# Altium project PLC M3.PrjPcb
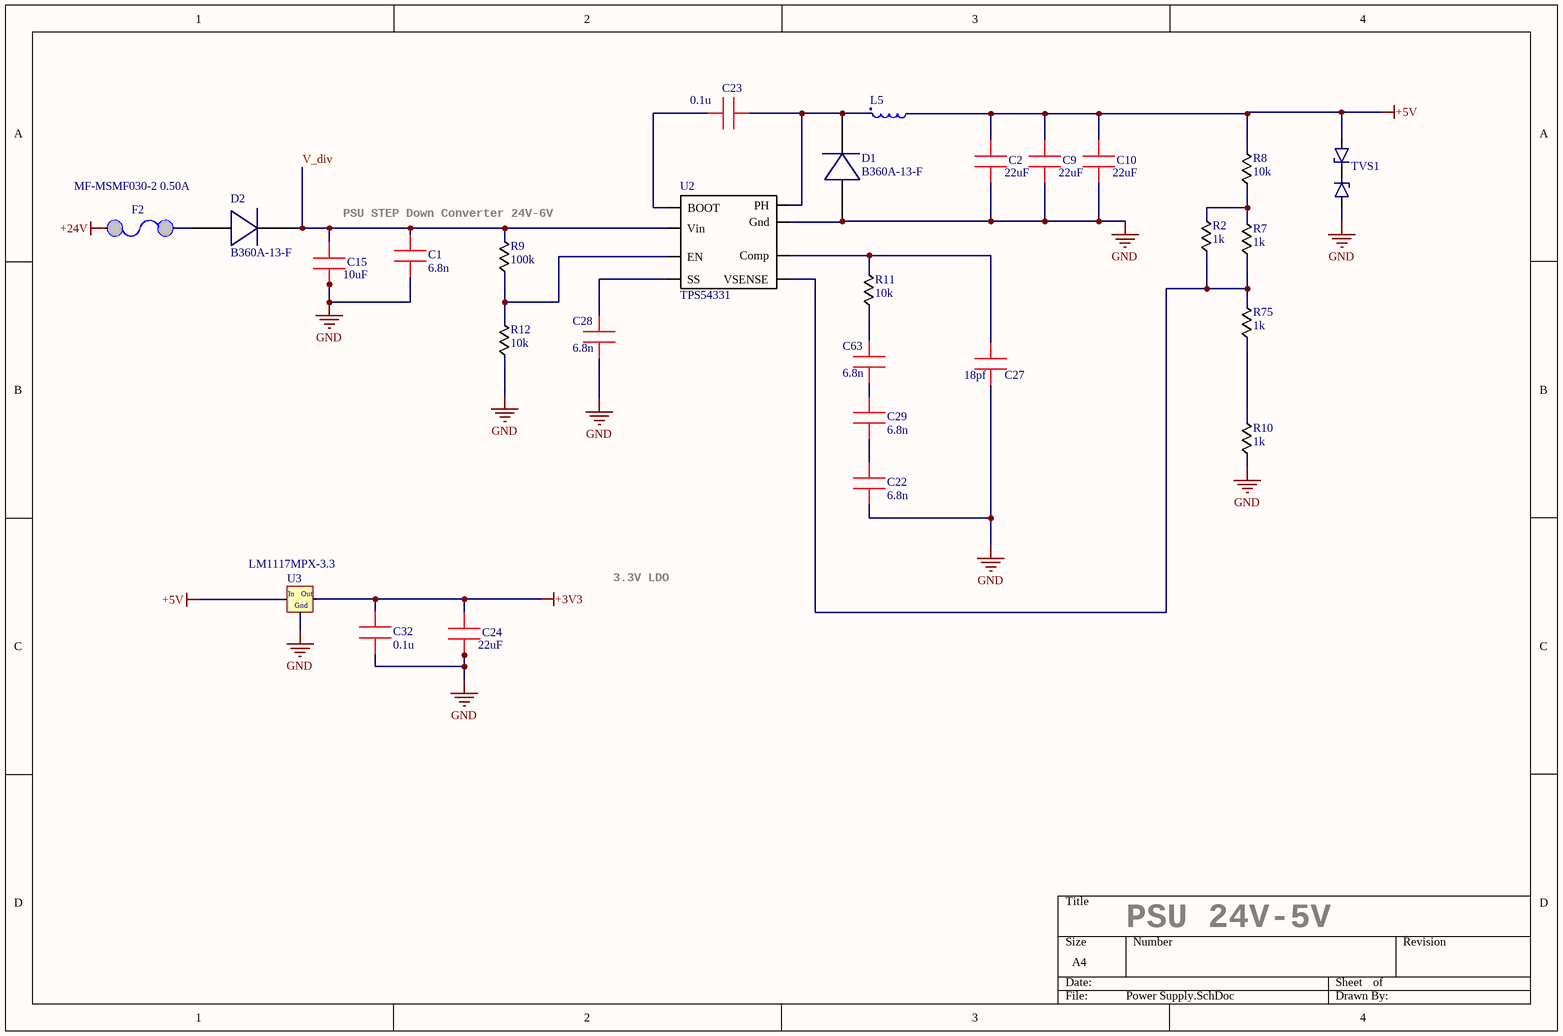
[diagram p0: Power Supply.SchDoc]
8 sheets, 240 parts. Net scope: global (net labels, ports and power ports of the same name join across sheets).
Board file: PLC M3 PCB.PcbDoc
Sheets:
  Power Supply.SchDoc
  LEDs.SchDoc
  Plugs.SchDoc
  Ethernet.SchDoc
  SD Holder.SchDoc
  Processor.SchDoc
  RS485.SchDoc
  ETH_HMI.SchDoc

## Sheet Power Supply.SchDoc
size A4

### Parts
C1  6.8n  [0603 CAP]
C2  22uF  [CAP CER 1210 NP]
C9  22uF  [CAP CER 1210 NP]
C10  22uF  [CAP CER 1210 NP]
C15  10uF  [CAP CER 1210 NP]
C22  6.8n  [0603 CAP]
C23  0.1u  [0603 CAP]
C24  22uF  [CAP CER 1210 NP]
C27  18pf  [0603 CAP]
C28  6.8n  [0603 CAP]
C29  6.8n  [0603 CAP]
C32  0.1u  [0603 CAP]
C63  6.8n  [0603 CAP]
D1  B360A-13-F  [B340A-13-F]
D2  B360A-13-F  [B340A-13-F]
F2  MF-MSMF030-2 0.50A  [Fuse PTS]
L5  CDRH127/LDNP-220MC  [CDRH127/LDNP-270MC,]  (value not drawn)
R2  1k  [0603 - RES]
R7  1k  [0603 - RES]
R8  10k  [0603 - RES]
R9  100k  [0603 - RES]
R10  1k  [0603 - RES]
R11  10k  [0603 - RES]
R12  10k  [0603 - RES]
R75  1k  [0603 - RES]
TVS1  TVS Diode  [SM6T]  (value not drawn)
U2  TPS54331  [SOIC-8]
U3  LM1117MPX-3.3  [SOT223]

### Nets
+3V3: C24.2 C32.1 U3.2(OUT)
+5V: C2.2 C9.2 C10.2 L5.2 R8.2 TVS1.2 U3.3(IN)
+24V: F2.2
GND: C1.1 C2.1 C9.1 C10.1 C15.1 C22.1 C24.1 C27.1 C28.1 C32.2 D1.2 R10.1 R12.1 TVS1.1 U2.7(Gnd) U3.1(GND)
V_div: C1.2 C15.2 D2.1 R9.2 U2.2(Vin)
NetC22_2: C22.2 C29.1
NetC23_1: C23.1 U2.1(BOOT)
NetC23_2: C23.2 D1.1 L5.1 U2.8(PH)
NetC27_2: C27.2 R11.2 U2.6(Comp)
NetC28_2: C28.2 U2.4(SS)
NetC29_2: C29.2 C63.1
NetC63_2: C63.2 R11.1
NetD2_2: D2.2 F2.1
NetR2_1: R2.1 R7.1 R75.2 U2.5(VSENSE)
NetR2_2: R2.2 R7.2 R8.1
NetR9_1: R9.1 R12.2 U2.3(EN)
NetR10_2: R10.2 R75.1

### Notes on the sheet
- PSU STEP Down Converter 24V-6V
- 3.3V LDO
- PSU 24V-5V
- (in symbol NCV1117ST50T3G) In; Out; Gnd

### Library data of the parts
C1 C22 = 0603 CAP: CC0603KRX7R9BB682
C2 C9 C10 C24 = 0805 Cap: CC1210KKX5R7BB226
C15 = 0805 Cap: GRM32ER71H106KA12L
C23 C28 C29 C63 = 0805 Cap: GRM188R71E104KA01D
C27 = 0805 Cap: GRM1885C1H180JA01D
C32 = Capasitor 0805
D1 D2 = B340A-13-F
F2 = Fuse PTS
L5 = CDRH127/LDNP-270MC
R2 R7 R10 R75 = Resistor 0805: RC0603FR-078K2
R8 R11 R12 = Resistor 0805: RT0603FRE0710KL
R9 = 0603 RES: RC0603FR-07100KL
TVS1 = SM6T12CA
U3 = NCV1117ST50T3G

## Sheet LEDs.SchDoc
size A4
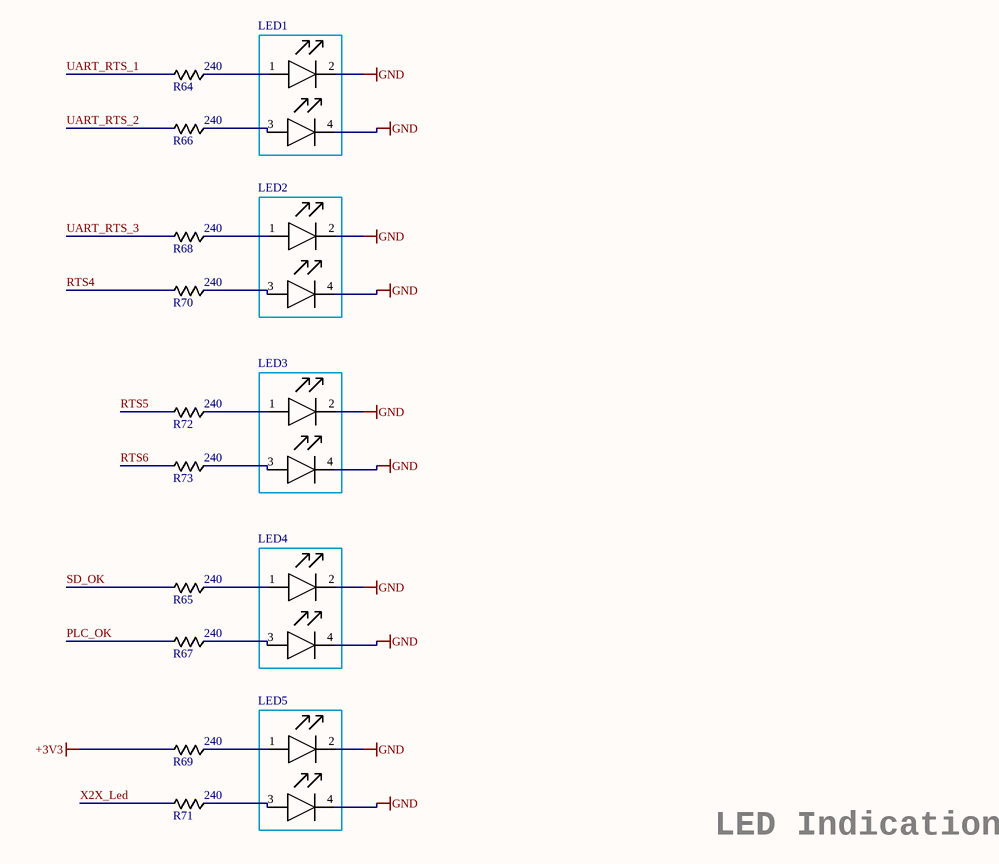
[diagram p1: LEDs.SchDoc]

### Parts
LED1  Light Guide 2  [LED SMD DayLight]  (value not drawn)
LED2  Light Guide 2  [LED SMD DayLight]  (value not drawn)
LED3  Light Guide 2  [LED SMD DayLight]  (value not drawn)
LED4  Light Guide 2  [LED SMD DayLight]  (value not drawn)
LED5  Light Guide 2  [LED SMD DayLight]  (value not drawn)
R64  240  [0603 - RES]
R65  240  [0603 - RES]
R66  240  [0603 - RES]
R67  240  [0603 - RES]
R68  240  [0603 - RES]
R69  240  [0603 - RES]
R70  240  [0603 - RES]
R71  240  [0603 - RES]
R72  240  [0603 - RES]
R73  240  [0603 - RES]

### Nets
+3V3: R69.2
GND: LED1.2 LED1.4 LED2.2 LED2.4 LED3.2 LED3.4 LED4.2 LED4.4 LED5.2 LED5.4
PLC_OK: R67.2
RTS4: R70.2
RTS5: R72.2
RTS6: R73.2
SD_OK: R65.2
UART_RTS_1: R64.2
UART_RTS_2: R66.2
UART_RTS_3: R68.2
X2X_Led: R71.2
NetLED1_1: LED1.1 R64.1
NetLED1_3: LED1.3 R66.1
NetLED2_1: LED2.1 R68.1
NetLED2_3: LED2.3 R70.1
NetLED3_1: LED3.1 R72.1
NetLED3_3: LED3.3 R73.1
NetLED4_1: LED4.1 R65.1
NetLED4_3: LED4.3 R67.1
NetLED5_1: LED5.1 R69.1
NetLED5_3: LED5.3 R71.1

### Notes on the sheet
- LED Indication

### Library data of the parts
LED1-LED3 = Light Guide 2: KP-1608SYC
LED4 LED5 = Light Guide 2: KP-1608SGC
R64-R73 = Resistor 0805: 0805 SMD Resistor

## Sheet Plugs.SchDoc
size A4
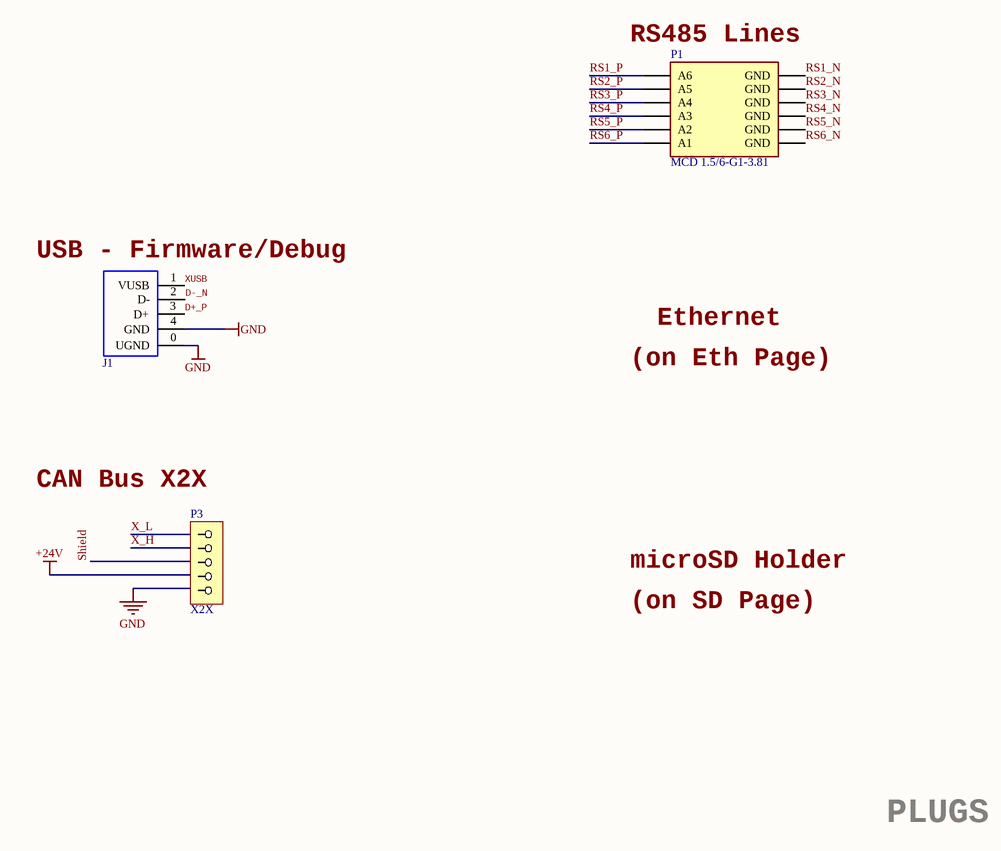
[diagram p2: Plugs.SchDoc]

### Parts
J1  USBB-1J  [USB B]  (value not drawn)
P1  MCD 1.5/6-G1-3.81  [mcd 1,5/6-G1-3.81]
P3  X2X  [PhClass5]

### Nets
+24V: P3.4
GND: J1.0(UGND) J1.4(GND) P3.5
D+_P: J1.3(D+)
D-_N: J1.2(D-)
RS1_N: P1.2(GND)
RS1_P: P1.1(A6)
RS2_N: P1.4(GND)
RS2_P: P1.3(A5)
RS3_N: P1.6(GND)
RS3_P: P1.5(A4)
RS4_N: P1.8(GND)
RS4_P: P1.7(A3)
RS5_N: P1.10(GND)
RS5_P: P1.9(A2)
RS6_N: P1.12(GND)
RS6_P: P1.11(A1)
Shield: P3.3
X_H: P3.2
X_L: P3.1
XUSB: J1.1(VUSB)

### Notes on the sheet
- (near P1) RS485 Lines
- (near J1) USB - Firmware/Debug
- Ethernet
- (on Eth Page)
- (near P3) CAN Bus X2X
- microSD Holder
- (on SD Page)
- PLUGS

### Library data of the parts
P1 = Header 6X2: Header, 6-Pin, Dual row; LatestRevisionDate: 17-Jul-2002; LatestRevisionNote: Re-released for DXP Platform.; Publisher: Altium Limited
P3 = EMSTBA 2.5/5-G-5.08

## Sheet Ethernet.SchDoc
size A3
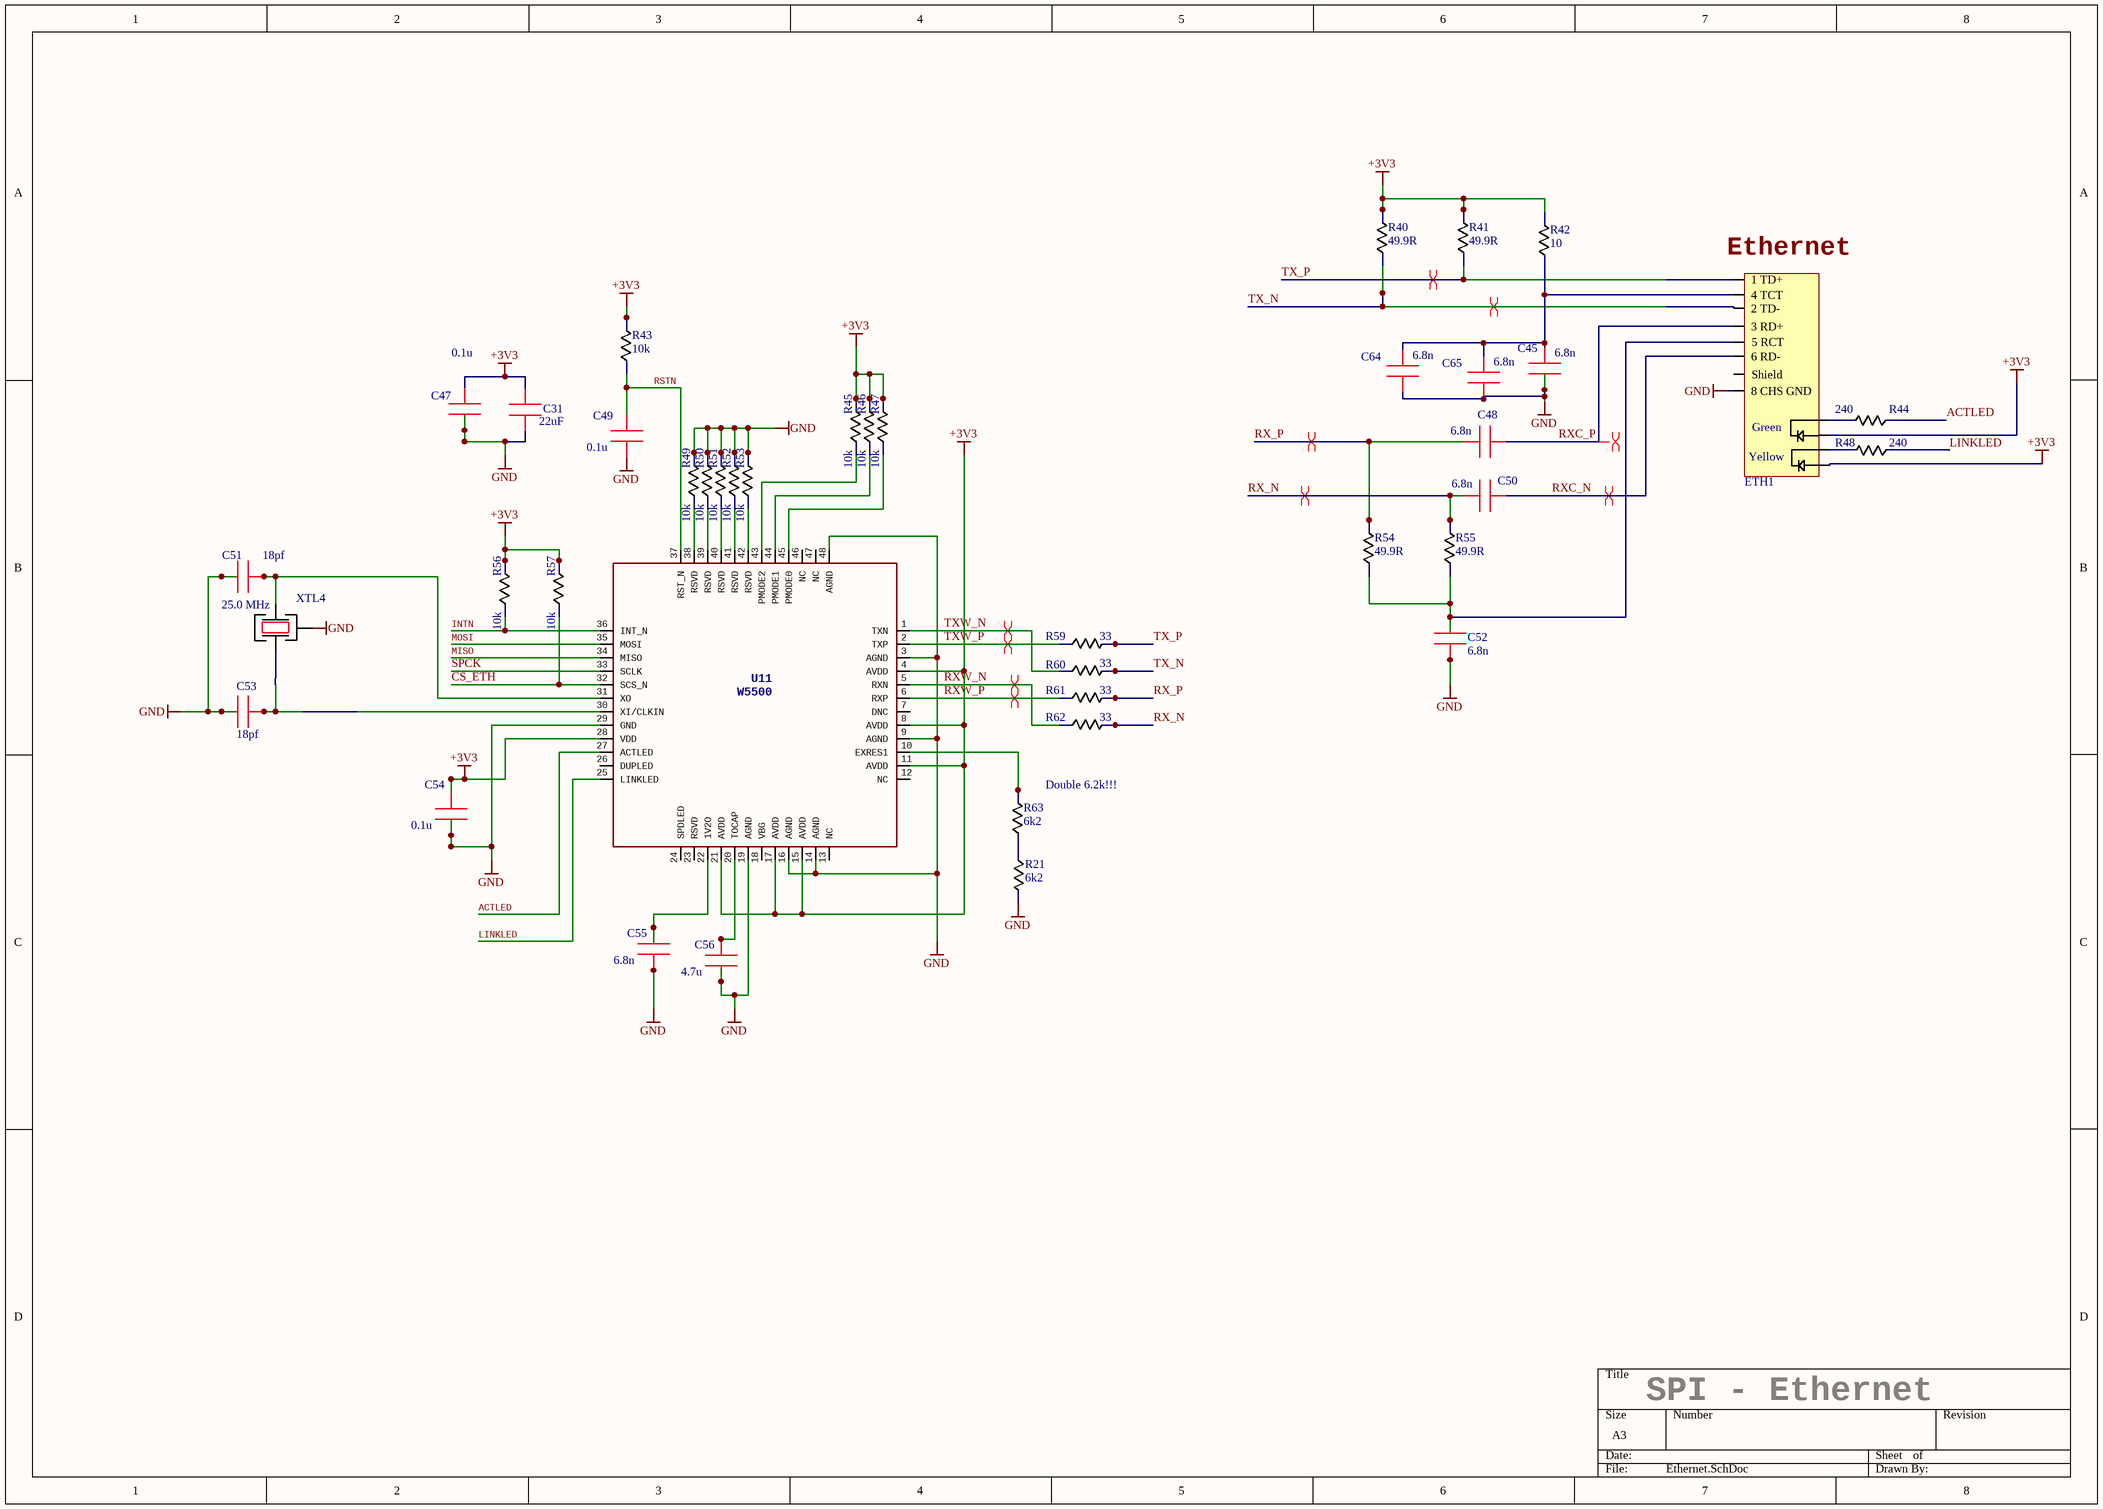
[diagram p3: Ethernet.SchDoc]

### Parts
C31  22uF  [CAP CER 1210 NP]
C45  6.8n  [0603 CAP]
C47  0.1u  [0603 CAP]
C48  6.8n  [0603 CAP]
C49  0.1u  [0603 CAP]
C50  6.8n  [0603 CAP]
C51  18pf  [0603 CAP]
C52  6.8n  [0603 CAP]
C53  18pf  [0603 CAP]
C54  0.1u  [0603 CAP]
C55  6.8n  [0603 CAP]
C56  4.7u  [0603 CAP]
C64  6.8n  [0603 CAP]
C65  6.8n  [0603 CAP]
ETH1  ETH?  [J011D21BNL]  (value not drawn)
R21  6k2  [0603 - RES]
R40  49.9R  [0603 - RES]
R41  49.9R  [0603 - RES]
R42  10  [0603 - RES]
R43  10k  [0603 - RES]
R44  240  [0603 - RES]
R45  10k  [0603 - RES]
R46  10k  [0603 - RES]
R47  10k  [0603 - RES]
R48  240  [0603 - RES]
R49  10k  [0603 - RES]
R50  10k  [0603 - RES]
R51  10k  [0603 - RES]
R52  10k  [0603 - RES]
R53  10k  [0603 - RES]
R54  49.9R  [0603 - RES]
R55  49.9R  [0603 - RES]
R56  10k  [0603 - RES]
R57  10k  [0603 - RES]
R59  33  [0603 - RES]
R60  33  [0603 - RES]
R61  33  [0603 - RES]
R62  33  [0603 - RES]
R63  6k2  [0603 - RES]
U11  W5500  [LQFP 48]
XTL4  25.0 MHz  [XTAL KX-7T]

### Nets
+3V3: C31.2 C47.1 C54.1 ETH1.9(LDGr) ETH1.12(LDYE) R40.2 R41.2 R42.2 R43.2 R45.2 R46.2 R47.2 R56.2 R57.2 U11.4(AVDD) U11.8(AVDD) U11.11(AVDD) U11.15(AVDD) U11.17(AVDD) U11.21(AVDD) U11.28(VDD)
GND: C31.1 C45.2 C47.2 C49.2 C51.1 C52.2 C53.1 C54.2 C55.2 C56.2 C64.2 C65.2 ETH1.8(8_CHS_GND) R21.2 R49.2 R50.2 R51.2 R52.2 R53.2 U11.3(AGND) U11.9(AGND) U11.14(AGND) U11.16(AGND) U11.19(AGND) U11.29(GND) U11.48(AGND) XTL4.2
ACTLED: R44.1 U11.27(ACTLED)
CS_ETH: R57.1 U11.32(SCS_N)
INTN: R56.1 U11.36(INT_N)
LINKLED: R48.1 U11.25(LINKLED)
MISO: U11.34(MISO)
MOSI: U11.35(MOSI)
RSTN: C49.1 R43.1 U11.37(RST_N)
RX_N: C50.1 R55.2 R62.2
RX_P: C48.1 R54.2 R61.2
RXC_N: C50.2 ETH1.6(6_RD-)
RXC_P: C48.2 ETH1.3(3_RD+)
RXW_N: R62.1 U11.5(RXN)
RXW_P: R61.1 U11.6(RXP)
SPCK: U11.33(SCLK)
TX_N: ETH1.2(2_TD-) R40.1 R60.2
TX_P: ETH1.1(1_TD+) R41.1 R59.2
TXW_N: R60.1 U11.1(TXN)
TXW_P: R59.1 U11.2(TXP)
NetC45_1: C45.1 C64.1 C65.1 ETH1.4(4_TCT) R42.1
NetC51_2: C51.2 U11.31(XO) XTL4.3
NetC52_1: C52.1 ETH1.5(5_RCT) R54.1 R55.1
NetC53_2: C53.2 U11.30(XI/CLKIN) XTL4.1
NetC55_1: C55.1 U11.22(1V2O)
NetC56_1: C56.1 U11.20(TOCAP)
NetETH1_10: ETH1.10(LDGr) R44.2
NetETH1_11: ETH1.11(LDYE) R48.2
NetR21_1: R21.1 R63.1
NetR45_1: R45.1 U11.43(PMODE2)
NetR46_1: R46.1 U11.44(PMODE1)
NetR47_1: R47.1 U11.45(PMODE0)
NetR49_1: R49.1 U11.38(RSVD)
NetR50_1: R50.1 U11.39(RSVD)
NetR51_1: R51.1 U11.40(RSVD)
NetR52_1: R52.1 U11.41(RSVD)
NetR53_1: R53.1 U11.42(RSVD)
NetR63_2: R63.2 U11.10(EXRES1)

Not connected (* = marked no-connect by the designer): ETH1 SHIELD(Shield); U11 7(DNC) 12(NC) 13(NC) 18(VBG) 23(RSVD) 24(SPDLED) 26(DUPLED) 46(NC) 47(NC)

### Layout directives
differential pair: RX_N, RX_P, RXC_N, RXC_P, RXW_N, RXW_P, TX_N, TX_P, TXW_N, TXW_P

### Notes on the sheet
- (near ETH1) Ethernet
- (near R63) Double 6.2k!!!
- SPI - Ethernet
- (in symbol J0011D21BNL) Green; Yellow

### Library data of the parts
C31 = 0805 Cap: CC1210KKX5R7BB226
C45 C64 C65 = 0603 CAP: GRM188R71H223KA01D
C47 C49 C54 = 0603 CAP: GRM188R71E104KA01D
C48 C50 = 0603 CAP: CC0603KRX7R9BB682
C51 C53 = 0603 CAP: GRM1885C1H180JA01D
C52 C55 = 0603 CAP
C56 = 0603 CAP: GRM188R61A475KE15D
ETH1 = J0011D21BNL
R21 = Resistor 0805: 0805 SMD Resistor
R40 R41 R54 R55 = 0603 RES: RC0603FR-0749R9
R42 R44 R48 = 0603 RES: CRCW060310R0FKEA
R43 R45-R47 R49-R53 R56 R57 = 0603 RES: RC0603JR-0710K
R59-R62 = 0603 RES: RC0603FR-0733R
R63 = 0603 RES: RC0603FR-076K2
XTL4 = KX-7: Geyer KX-7 25.0 MHz

## Sheet SD Holder.SchDoc
size A4
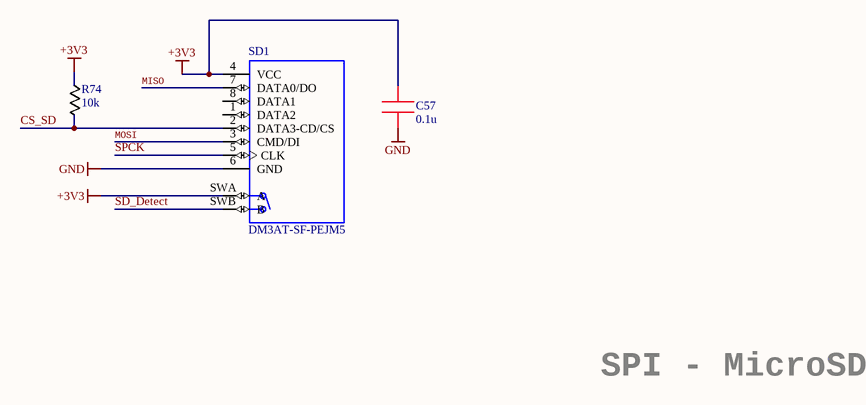
[diagram p4: SD Holder.SchDoc]

### Parts
C57  0.1u  [0603 CAP]
R74  10k  [0603 - RES]
SD1  DM3AT-SF-PEJM5  [DM3AT-SF-PEJM5]

### Nets
+3V3: C57.2 R74.1 SD1.4(VCC) SD1.SWA(A)
GND: C57.1 SD1.6(GND)
CS_SD: R74.2 SD1.2(DATA3-CD/CS)
MISO: SD1.7(DATA0/DO)
MOSI: SD1.3(CMD/DI)
SD_Detect: SD1.SWB(B)
SPCK: SD1.5(CLK)

Not connected (* = marked no-connect by the designer): SD1 1(DATA2) 8(DATA1)

### Notes on the sheet
- SPI - MicroSD

### Library data of the parts
C57 = 0603 CAP: GRM188R71E104KA01D
R74 = 0603 RES: RC0603JR-0710K

## Sheet Processor.SchDoc
size A3
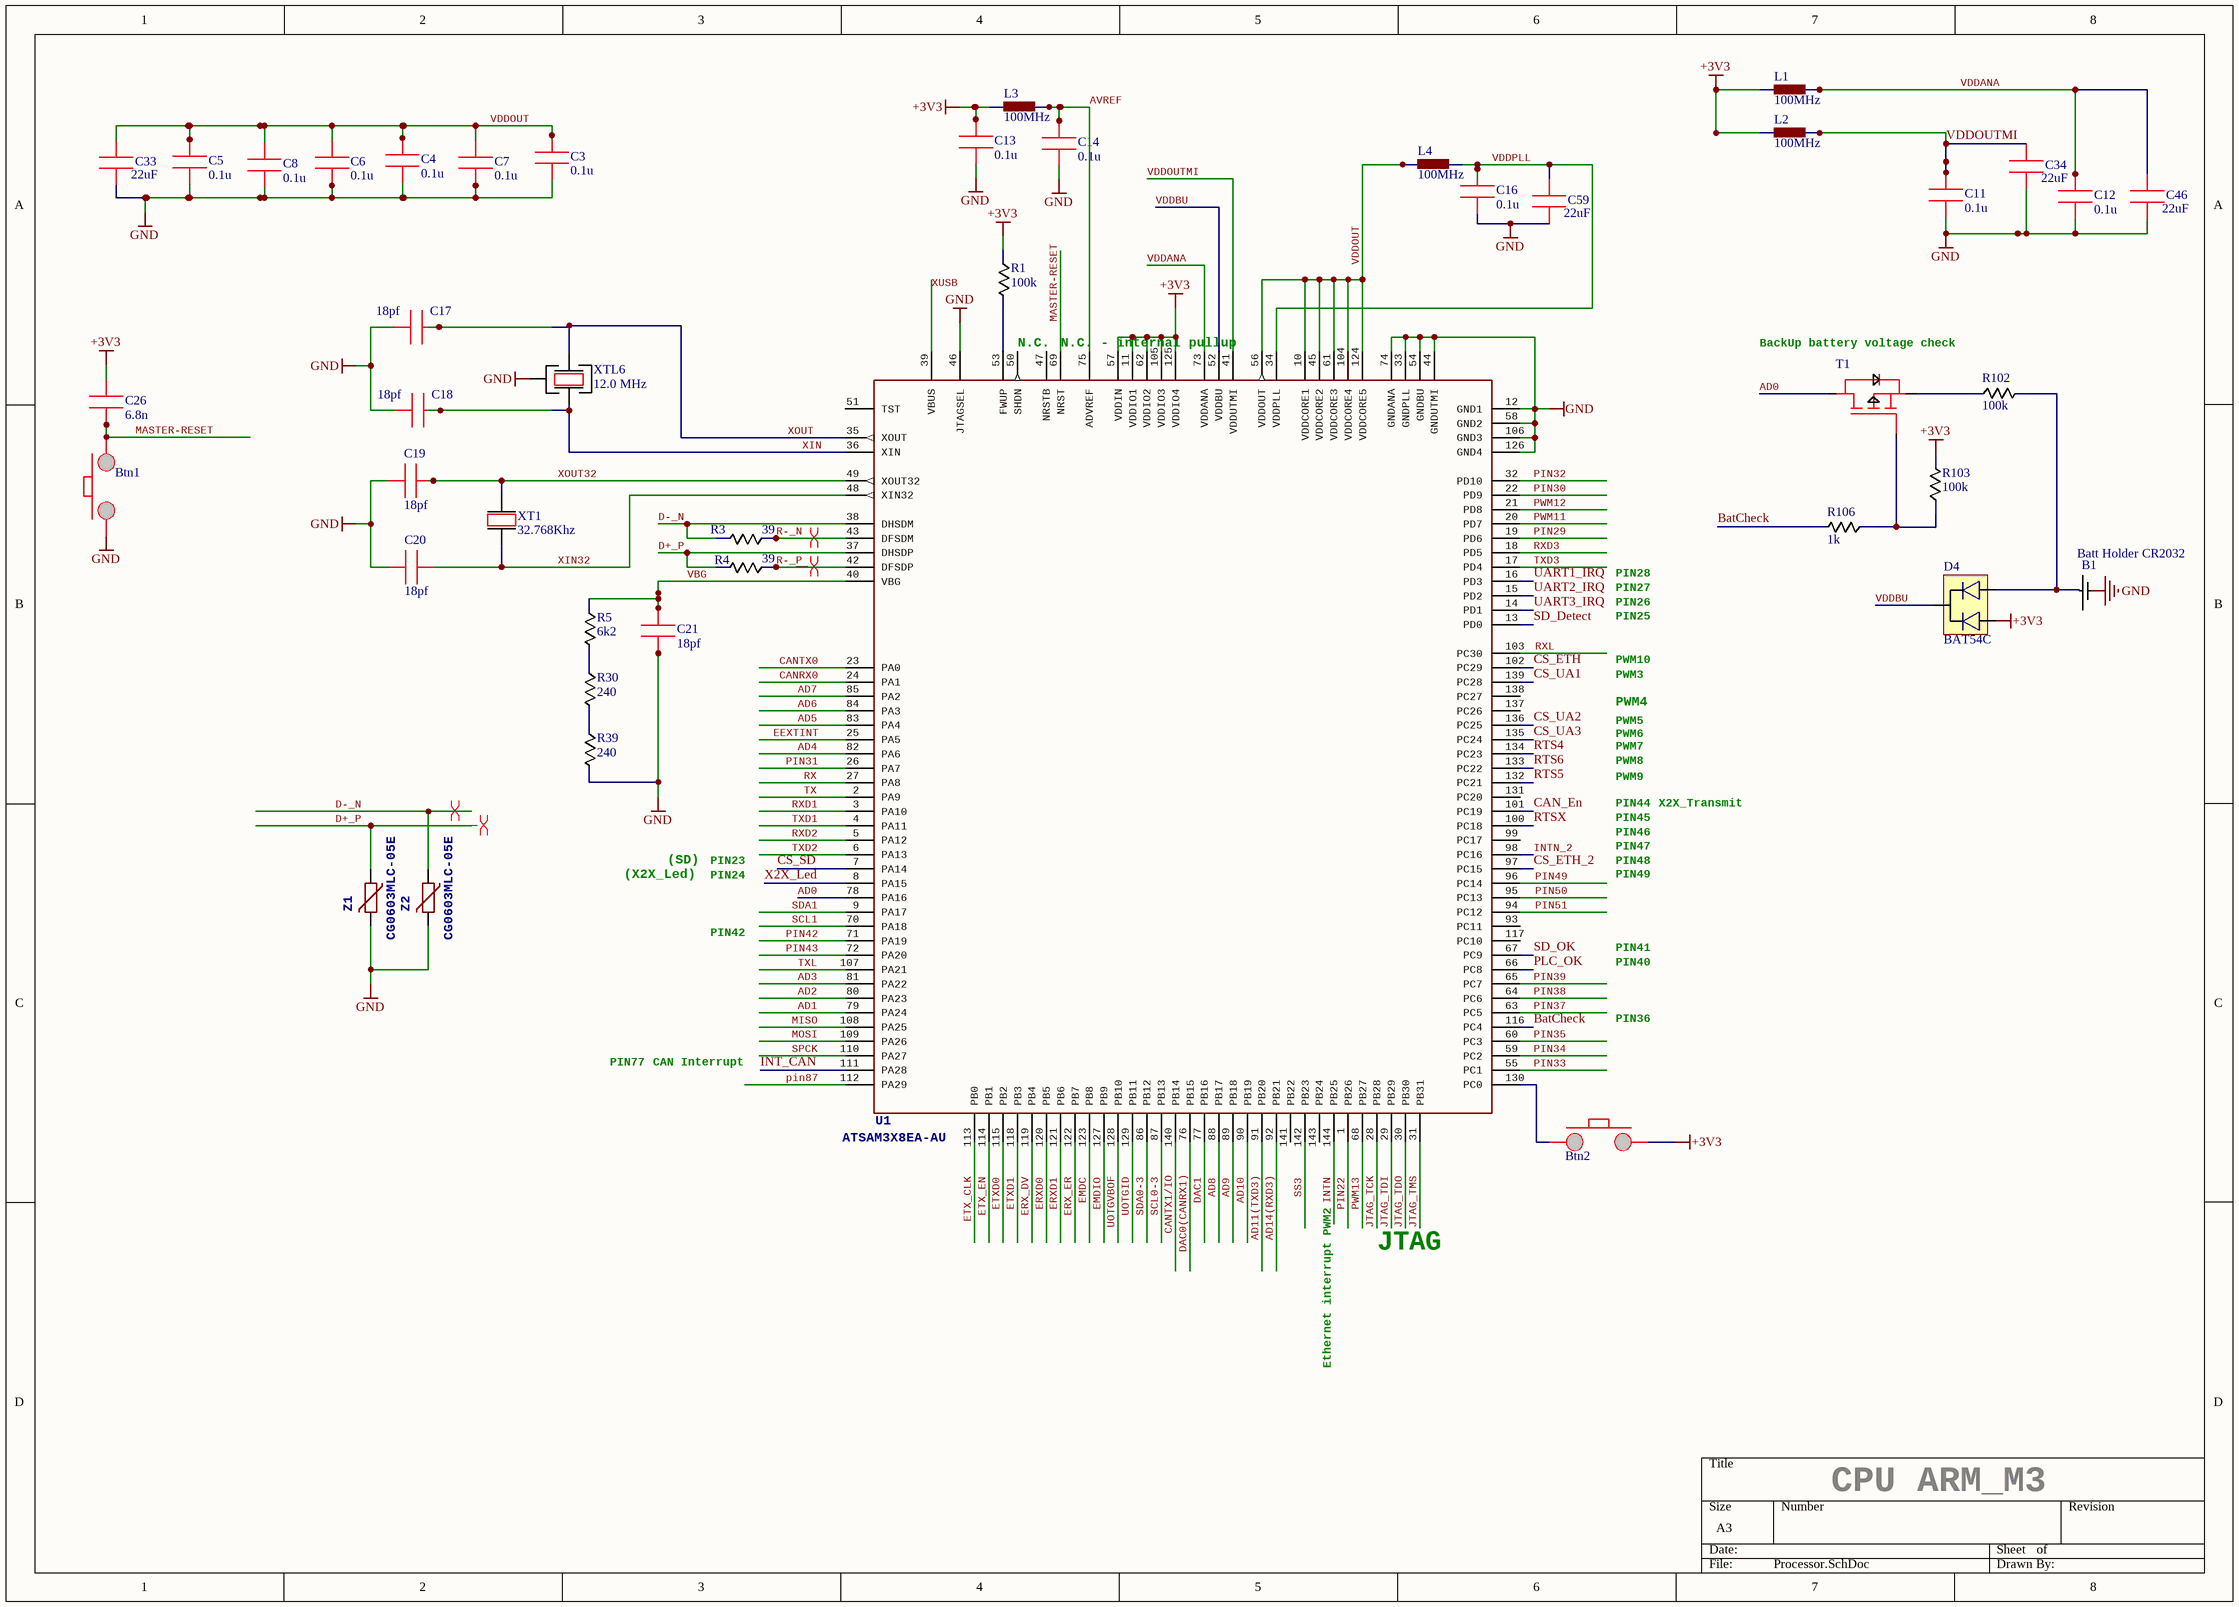
[diagram p5: Processor.SchDoc]

### Parts
B1  Batt Holder CR2032  [Batt Holder CR2032]
Btn1  Tact Switch  [Tact Switch]  (value not drawn)
Btn2  Tact Switch  [Tact Switch]  (value not drawn)
C3  0.1u  [0603 CAP]
C4  0.1u  [0603 CAP]
C5  0.1u  [0603 CAP]
C6  0.1u  [0603 CAP]
C7  0.1u  [0603 CAP]
C8  0.1u  [0603 CAP]
C11  0.1u  [0603 CAP]
C12  0.1u  [0603 CAP]
C13  0.1u  [0603 CAP]
C14  0.1u  [0603 CAP]
C16  0.1u  [0603 CAP]
C17  18pf  [0603 CAP]
C18  18pf  [0603 CAP]
C19  18pf  [0603 CAP]
C20  18pf  [0603 CAP]
C21  18pf  [0603 CAP]
C26  6.8n  [0603 CAP]
C33  22uF  [CAP CER 1210 NP]
C34  22uF  [CAP CER 1210 NP]
C46  22uF  [CAP CER 1210 NP]
C59  22uF  [CAP CER 1210 NP]
D4  BAT54C  [SOT23]
L1  100MHz  [0805]
L2  100MHz  [0805]
L3  100MHz  [0805]
L4  100MHz  [0805]
R1  100k  [0603 - RES]
R3  39  [0603 - RES]
R4  39  [0603 - RES]
R5  6k2  [0603 - RES]
R30  240  [0603 - RES]
R39  240  [0603 - RES]
R102  100k  [0603 - RES]
R103  100k  [0603 - RES]
R106  1k  [0603 - RES]
T1  IRLML6302  [SOT23]  (value not drawn)
U1  ATSAM3X8EA-AU  [LQFP144]
XT1  32.768Khz  [XTAL KX-327T]
XTL6  12.0 MHz  [XTAL KX-7T]
Z1  CG0603MLC-05E  [0603 - RES]
Z2  CG0603MLC-05E  [0603 - RES]

### Nets
+3V3: Btn2.1 C13.2 C26.2 D4.1 L1.1 L2.1 L3.1 R1.1 R103.2 U1.11(VDDIO1) U1.57(VDDIN) U1.62(VDDIO2) U1.105(VDDIO3) U1.125(VDDIO4)
GND: B1.0 Btn1.0 C3.1 C4.1 C5.1 C6.1 C7.1 C8.1 C11.1 C12.1 C13.1 C14.1 C16.1 C17.1 C18.1 C19.2 C20.2 C21.1 C33.1 C34.1 C46.1 C59.1 R39.2 U1.12(GND1) U1.33(GNDPLL) U1.44(GNDUTMI) U1.46(JTAGSEL) U1.54(GNDBU) U1.58(GND2) U1.74(GNDANA) U1.106(GND3) U1.126(GND4) XTL6.2 Z1.2 Z2.2
AD0: T1.3 U1.78(PA16)
AD1: U1.79(PA24)
AD2: U1.80(PA23)
AD3: U1.81(PA22)
AD4: U1.82(PA6)
AD5: U1.83(PA4)
AD6: U1.84(PA3)
AD7: U1.85(PA2)
AD8: U1.88(PB17)
AD9: U1.89(PB18)
AD10: U1.90(PB19)
AD11(TXD3): U1.91(PB20)
AD14(RXD3): U1.92(PB21)
AVREF: C14.2 L3.2 U1.75(ADVREF)
BatCheck: R106.2 U1.116(PC4)
CAN_En: U1.101(PC19)
CANRX0: U1.24(PA1)
CANTX0: U1.23(PA0)
CANTX1/IO: U1.140(PB14)
CS_ETH: U1.102(PC29)
CS_ETH_2: U1.97(PC15)
CS_SD: U1.7(PA14)
CS_UA1: U1.139(PC28)
CS_UA2: U1.136(PC25)
CS_UA3: U1.135(PC24)
D+_P: R4.2 U1.37(DHSDP) Z1.1
D-_N: R3.2 U1.38(DHSDM) Z2.1
DAC0(CANRX1): U1.76(PB15)
DAC1: U1.77(PB16)
EEXTINT: U1.25(PA5)
EMDC: U1.123(PB8)
EMDIO: U1.127(PB9)
ERX_DV: U1.119(PB4)
ERX_ER: U1.122(PB7)
ERXD0: U1.120(PB5)
ERXD1: U1.121(PB6)
ETX_CLK: U1.113(PB0)
ETX_EN: U1.114(PB1)
ETXD0: U1.115(PB2)
ETXD1: U1.118(PB3)
INT_CAN: U1.111(PA28)
INTN: U1.144(PB25)
INTN_2: U1.98(PC16)
JTAG_TCK: U1.28(PB28)
JTAG_TDI: U1.29(PB29)
JTAG_TDO: U1.30(PB30)
JTAG_TMS: U1.31(PB31)
MASTER-RESET: Btn1.1 C26.1 U1.69(NRST)
MISO: U1.108(PA25)
MOSI: U1.109(PA26)
PIN22: U1.1(PB26)
PIN29: U1.19(PD6)
PIN30: U1.22(PD9)
PIN31: U1.26(PA7)
PIN32: U1.32(PD10)
PIN33: U1.55(PC1)
PIN34: U1.59(PC2)
PIN35: U1.60(PC3)
PIN37: U1.63(PC5)
PIN38: U1.64(PC6)
PIN39: U1.65(PC7)
PIN42: U1.71(PA19)
PIN43: U1.72(PA20)
PIN49: U1.96(PC14)
PIN50: U1.95(PC13)
PIN51: U1.94(PC12)
pin87: U1.112(PA29)
PLC_OK: U1.66(PC8)
PWM11: U1.20(PD7)
PWM12: U1.21(PD8)
PWM13: U1.68(PB27)
R-_N: R3.1 U1.43(DFSDM)
R-_P: R4.1 U1.42(DFSDP)
RTS4: U1.134(PC23)
RTS5: U1.132(PC21)
RTS6: U1.133(PC22)
RTSX: U1.100(PC18)
RX: U1.27(PA8)
RXD1: U1.3(PA10)
RXD2: U1.5(PA12)
RXD3: U1.18(PD5)
RXL: U1.103(PC30)
SCL0-3: U1.87(PB13)
SCL1: U1.70(PA18)
SD_Detect: U1.13(PD0)
SD_OK: U1.67(PC9)
SDA0-3: U1.86(PB12)
SDA1: U1.9(PA17)
SPCK: U1.110(PA27)
SS3: U1.142(PB23)
TX: U1.2(PA9)
TXD1: U1.4(PA11)
TXD2: U1.6(PA13)
TXD3: U1.17(PD4)
TXL: U1.107(PA21)
UART1_IRQ: U1.16(PD3)
UART2_IRQ: U1.15(PD2)
UART3_IRQ: U1.14(PD1)
UOTGID: U1.129(PB11)
UOTGVBOF: U1.128(PB10)
VBG: C21.2 R5.1 U1.40(VBG)
VDDANA: C12.2 C46.2 L1.2 U1.73(VDDANA)
VDDBU: D4.3 U1.52(VDDBU)
VDDOUT: C3.2 C4.2 C5.2 C6.2 C7.2 C8.2 C33.2 L4.1 U1.10(VDDCORE1) U1.45(VDDCORE2) U1.56(VDDOUT) U1.61(VDDCORE3) U1.104(VDDCORE4) U1.124(VDDCORE5)
VDDOUTMI: C11.2 C34.2 L2.2 U1.41(VDDUTMI)
VDDPLL: C16.2 C59.2 L4.2 U1.34(VDDPLL)
X2X_Led: U1.8(PA15)
XIN: C18.2 U1.36(XIN) XTL6.3
XIN32: C20.1 U1.48(XIN32) XT1.1
XOUT: C17.2 U1.35(XOUT) XTL6.1
XOUT32: C19.1 U1.49(XOUT32) XT1.2
XUSB: U1.39(VBUS)
NetB1_1: B1.1 D4.2 R102.2
NetBtn2_0: Btn2.0 U1.130(PC0)
NetR1_2: R1.2 U1.53(FWUP)
NetR5_2: R5.2 R30.1
NetR30_2: R30.2 R39.1
NetR102_1: R102.1 T1.2
NetR103_1: R103.1 R106.1 T1.1

Not connected (* = marked no-connect by the designer): U1 47(NRSTB) 50(SHDN) 51(TST) 93(PC11) 99(PC17) 117(PC10) 131(PC20) 137(PC26) 138(PC27) 141(PB22) 143(PB24)

### Layout directives
differential pair: (no net found under the mark)

### Notes on the sheet
- N.C.
- (near U1) N.C. - internal pullup
- (near T1) BackUp battery voltage check
- PIN28
- PIN27
- PIN26
- PIN25
- PWM3
- PWM10
- PWM5
- PWM6
- PWM7
- PWM8
- PWM4
- PWM9
- PIN44
- PIN46
- PIN45
- X2X_Transmit
- (X2X_Led)
- (SD)
- PIN23
- PIN24
- PIN47
- PIN48
- PIN49
- PIN42
- PIN41
- PIN40
- PIN36
- PIN77
- CAN Interrupt
- PWM2
- JTAG
- Ethernet interrupt
- CPU ARM_M3

### Library data of the parts
B1 = Batt Holder CR2032: 1734178-1
Btn1 Btn2 = Tact Switch: KLS7-TS6606-4.3-180
C3-C8 C11-C14 C16 = Capasitor 0805
C17-C21 = Capasitor 0805: GRM1885C1H180JA01D
C26 = 0603 CAP: CC0603KRX7R9BB682
C33 C34 C46 C59 = 0805 Cap: CC1210KKX5R7BB226
L1-L4 = BLM21PG220SN1D
R1 R102 R103 = Resistor 0805: RC0603FR-07100KL
R3-R5 R30 R39 = Resistor 0805: 0805 SMD Resistor
R106 = Resistor 0805: RC0603FR-078K2
U1 = ATSAM3X/AAU
XT1 = KX – 327XS
XTL6 = KX-7: Geyer KX-7 12.0 MHz
Z1 Z2 = VARISTORCN0603: <b>VARISTOR</b>

## Sheet RS485.SchDoc
size A3
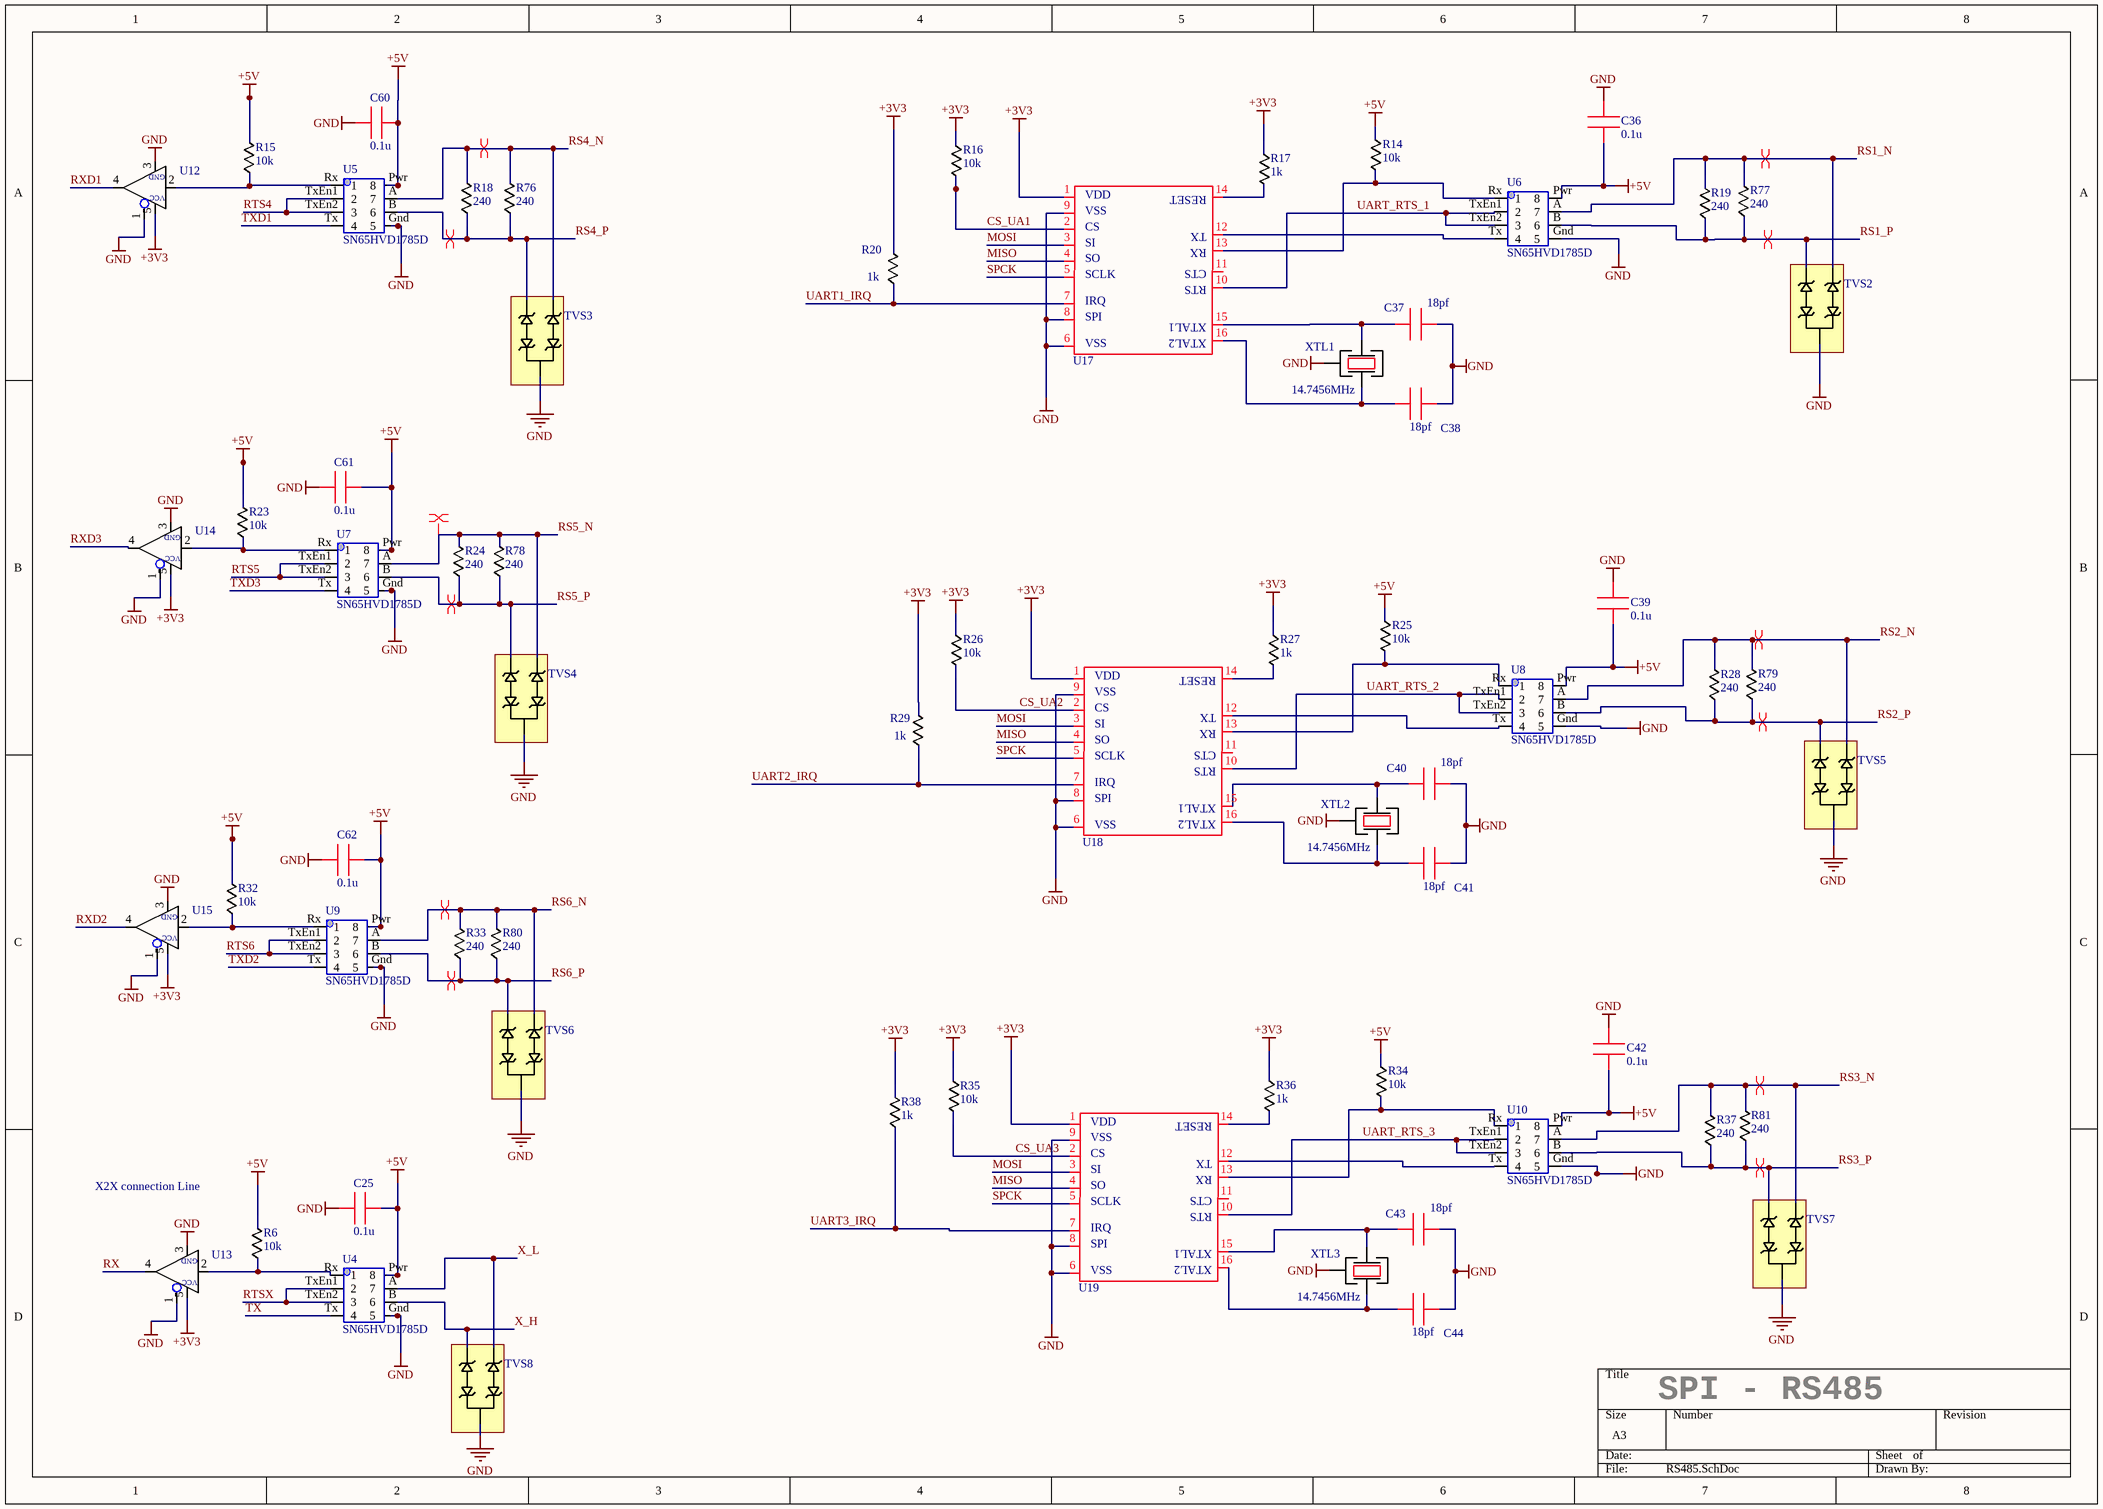
[diagram p6: RS485.SchDoc]

### Parts
C25  0.1u  [0603 CAP]
C36  0.1u  [0603 CAP]
C37  18pf  [0603 CAP]
C38  18pf  [0603 CAP]
C39  0.1u  [0603 CAP]
C40  18pf  [0603 CAP]
C41  18pf  [0603 CAP]
C42  0.1u  [0603 CAP]
C43  18pf  [0603 CAP]
C44  18pf  [0603 CAP]
C60  0.1u  [0603 CAP]
C61  0.1u  [0603 CAP]
C62  0.1u  [0603 CAP]
R6  10k  [0603 - RES]
R14  10k  [0603 - RES]
R15  10k  [0603 - RES]
R16  10k  [0603 - RES]
R17  1k  [0603 - RES]
R18  240  [0603 - RES]
R19  240  [0603 - RES]
R20  1k  [0603 - RES]
R23  10k  [0603 - RES]
R24  240  [0603 - RES]
R25  10k  [0603 - RES]
R26  10k  [0603 - RES]
R27  1k  [0603 - RES]
R28  240  [0603 - RES]
R29  1k  [0603 - RES]
R32  10k  [0603 - RES]
R33  240  [0603 - RES]
R34  10k  [0603 - RES]
R35  10k  [0603 - RES]
R36  1k  [0603 - RES]
R37  240  [0603 - RES]
R38  1k  [0603 - RES]
R76  240  [0603 - RES]
R77  240  [0603 - RES]
R78  240  [0603 - RES]
R79  240  [0603 - RES]
R80  240  [0603 - RES]
R81  240  [0603 - RES]
TVS2  CDSOT23-SM712  [Sot23-3]  (value not drawn)
TVS3  CDSOT23-SM712  [Sot23-3]  (value not drawn)
TVS4  CDSOT23-SM712  [Sot23-3]  (value not drawn)
TVS5  CDSOT23-SM712  [Sot23-3]  (value not drawn)
TVS6  CDSOT23-SM712  [Sot23-3]  (value not drawn)
TVS7  CDSOT23-SM712  [Sot23-3]  (value not drawn)
TVS8  CDSOT23-SM712  [Sot23-3]  (value not drawn)
U4  SN65HVD1785D  [MAX485 - duplicate]
U5  SN65HVD1785D  [MAX485 - duplicate]
U6  SN65HVD1785D  [MAX485 - duplicate]
U7  SN65HVD1785D  [MAX485 - duplicate]
U8  SN65HVD1785D  [MAX485 - duplicate]
U9  SN65HVD1785D  [MAX485 - duplicate]
U10  SN65HVD1785D  [MAX485 - duplicate]
U12  74LVC1G125DCK  [74LVC1G125DCK]  (value not drawn)
U13  74LVC1G125DCK  [74LVC1G125DCK]  (value not drawn)
U14  74LVC1G125DCK  [74LVC1G125DCK]  (value not drawn)
U15  74LVC1G125DCK  [74LVC1G125DCK]  (value not drawn)
U17  SC16IS740  [SC16IS740]  (value not drawn)
U18  SC16IS740  [SC16IS740]  (value not drawn)
U19  SC16IS740  [SC16IS740]  (value not drawn)
XTL1  14.7456MHz  [XTAL KX-7T]
XTL2  14.7456MHz  [XTAL KX-7T]
XTL3  14.7456MHz  [XTAL KX-7T]

### Nets
+3V3: R16.1 R17.1 R20.2 R26.1 R27.1 R29.2 R35.1 R36.1 R38.2 U12.5 U13.5 U14.5 U15.5 U17.1 U18.1 U19.1
+5V: C25.2 C36.2 C39.2 C42.2 C60.2 C61.2 C62.2 R6.2 R14.1 R15.2 R23.2 R25.1 R32.2 R34.1 U4.Pwr(8) U5.Pwr(8) U6.Pwr(8) U7.Pwr(8) U8.Pwr(8) U9.Pwr(8) U10.Pwr(8)
GND: C25.1 C36.1 C37.1 C38.1 C39.1 C40.1 C41.1 C42.1 C43.1 C44.1 C60.1 C61.1 C62.1 TVS2.3 TVS3.3 TVS4.3 TVS5.3 TVS6.3 TVS7.3 TVS8.3 U4.Gnd(5) U5.Gnd(5) U6.Gnd(5) U7.Gnd(5) U8.Gnd(5) U9.Gnd(5) U10.Gnd(5) U12.1 U12.3 U13.1 U13.3 U14.1 U14.3 U15.1 U15.3 U17.6 U17.8 U17.9 U18.6 U18.8 U18.9 U19.6 U19.8 U19.9 XTL1.2 XTL2.2 XTL3.2
CS_UA1: R16.2 U17.2
CS_UA2: R26.2 U18.2
CS_UA3: R35.2 U19.2
MISO: U17.4 U18.4 U19.4
MOSI: U17.3 U18.3 U19.3
RS1_N: R19.2 R77.2 TVS2.1 U6.A(7)
RS1_P: R19.1 R77.1 TVS2.2 U6.B(6)
RS2_N: R28.2 R79.2 TVS5.1 U8.A(7)
RS2_P: R28.1 R79.1 TVS5.2 U8.B(6)
RS3_N: R37.2 R81.2 TVS7.1 U10.A(7)
RS3_P: R37.1 R81.1 TVS7.2 U10.B(6)
RS4_N: R18.2 R76.2 TVS3.1 U5.A(7)
RS4_P: R18.1 R76.1 TVS3.2 U5.B(6)
RS5_N: R24.2 R78.2 TVS4.1 U7.A(7)
RS5_P: R24.1 R78.1 TVS4.2 U7.B(6)
RS6_N: R33.2 R80.2 TVS6.1 U9.A(7)
RS6_P: R33.1 R80.1 TVS6.2 U9.B(6)
RTS4: U5.TxEn1(2) U5.TxEn2(3)
RTS5: U7.TxEn1(2) U7.TxEn2(3)
RTS6: U9.TxEn1(2) U9.TxEn2(3)
RTSX: U4.TxEn1(2) U4.TxEn2(3)
RX: U13.4
RXD1: U12.4
RXD2: U15.4
RXD3: U14.4
SPCK: U17.5 U18.5 U19.5
TX: U4.Tx(4)
TXD1: U5.Tx(4)
TXD2: U9.Tx(4)
TXD3: U7.Tx(4)
UART1_IRQ: R20.1 U17.7
UART2_IRQ: R29.1 U18.7
UART3_IRQ: R38.1 U19.7
UART_RTS_1: U6.TxEn1(2) U6.TxEn2(3) U17.10
UART_RTS_2: U8.TxEn1(2) U8.TxEn2(3) U18.10
UART_RTS_3: U10.TxEn1(2) U10.TxEn2(3) U19.10
X_H: TVS8.2 U4.B(6)
X_L: TVS8.1 U4.A(7)
NetC37_2: C37.2 U17.15 XTL1.1
NetC38_2: C38.2 U17.16 XTL1.3
NetC40_2: C40.2 U18.15 XTL2.1
NetC41_2: C41.2 U18.16 XTL2.3
NetC43_2: C43.2 U19.15 XTL3.1
NetC44_2: C44.2 U19.16 XTL3.3
NetR6_1: R6.1 U4.Rx(1) U13.2
NetR14_2: R14.2 U6.Rx(1) U17.13
NetR15_1: R15.1 U5.Rx(1) U12.2
NetR17_2: R17.2 U17.14
NetR23_1: R23.1 U7.Rx(1) U14.2
NetR25_2: R25.2 U8.Rx(1) U18.13
NetR27_2: R27.2 U18.14
NetR32_1: R32.1 U9.Rx(1) U15.2
NetR34_2: R34.2 U10.Rx(1) U19.13
NetR36_2: R36.2 U19.14
NetU6_Tx: U6.Tx(4) U17.12
NetU8_Tx: U8.Tx(4) U18.12
NetU10_Tx: U10.Tx(4) U19.12

Not connected (* = marked no-connect by the designer): U17 11(8); U18 11(8); U19 11(8)

### Layout directives
differential pair: RS1_N, RS1_P, RS2_N, RS2_P, RS3_N, RS3_P, RS4_N, RS4_P, RS5_N, RS5_P, RS6_N, RS6_P

### Notes on the sheet
- X2X connection Line
- SPI - RS485
- (in symbol 74LVC1G125DCK) GND; VCC
- (in symbol SC16IS740) RESET; VDD; VSS; TX; CS; SI; RX; SO; CTS; SCLK; RTS; IRQ; SPI; XTAL1; XTAL2

### Library data of the parts
C25 C36 C39 C42 C60-C62 = Capasitor 0805
C37 C38 C40 C41 C43 C44 = Capasitor 0805: GRM1885C1H180JA01D
R6 R14 R15 R23 R25 R32 R34 = Resistor 0805: RC0603FR-078K2
R16 R17 R20 R26 R27 R29 R35 R36 R38 = Resistor 0805: RC0603JR-0710K
R18 R19 R24 R28 R33 R37 R76-R81 = Resistor 0805: RC0603JR-07120R
U4-U10 = MAX485
XTL1-XTL3 = KX-7: Geyer KX-7 14.7456MHz

## Sheet ETH_HMI.SchDoc
size A3
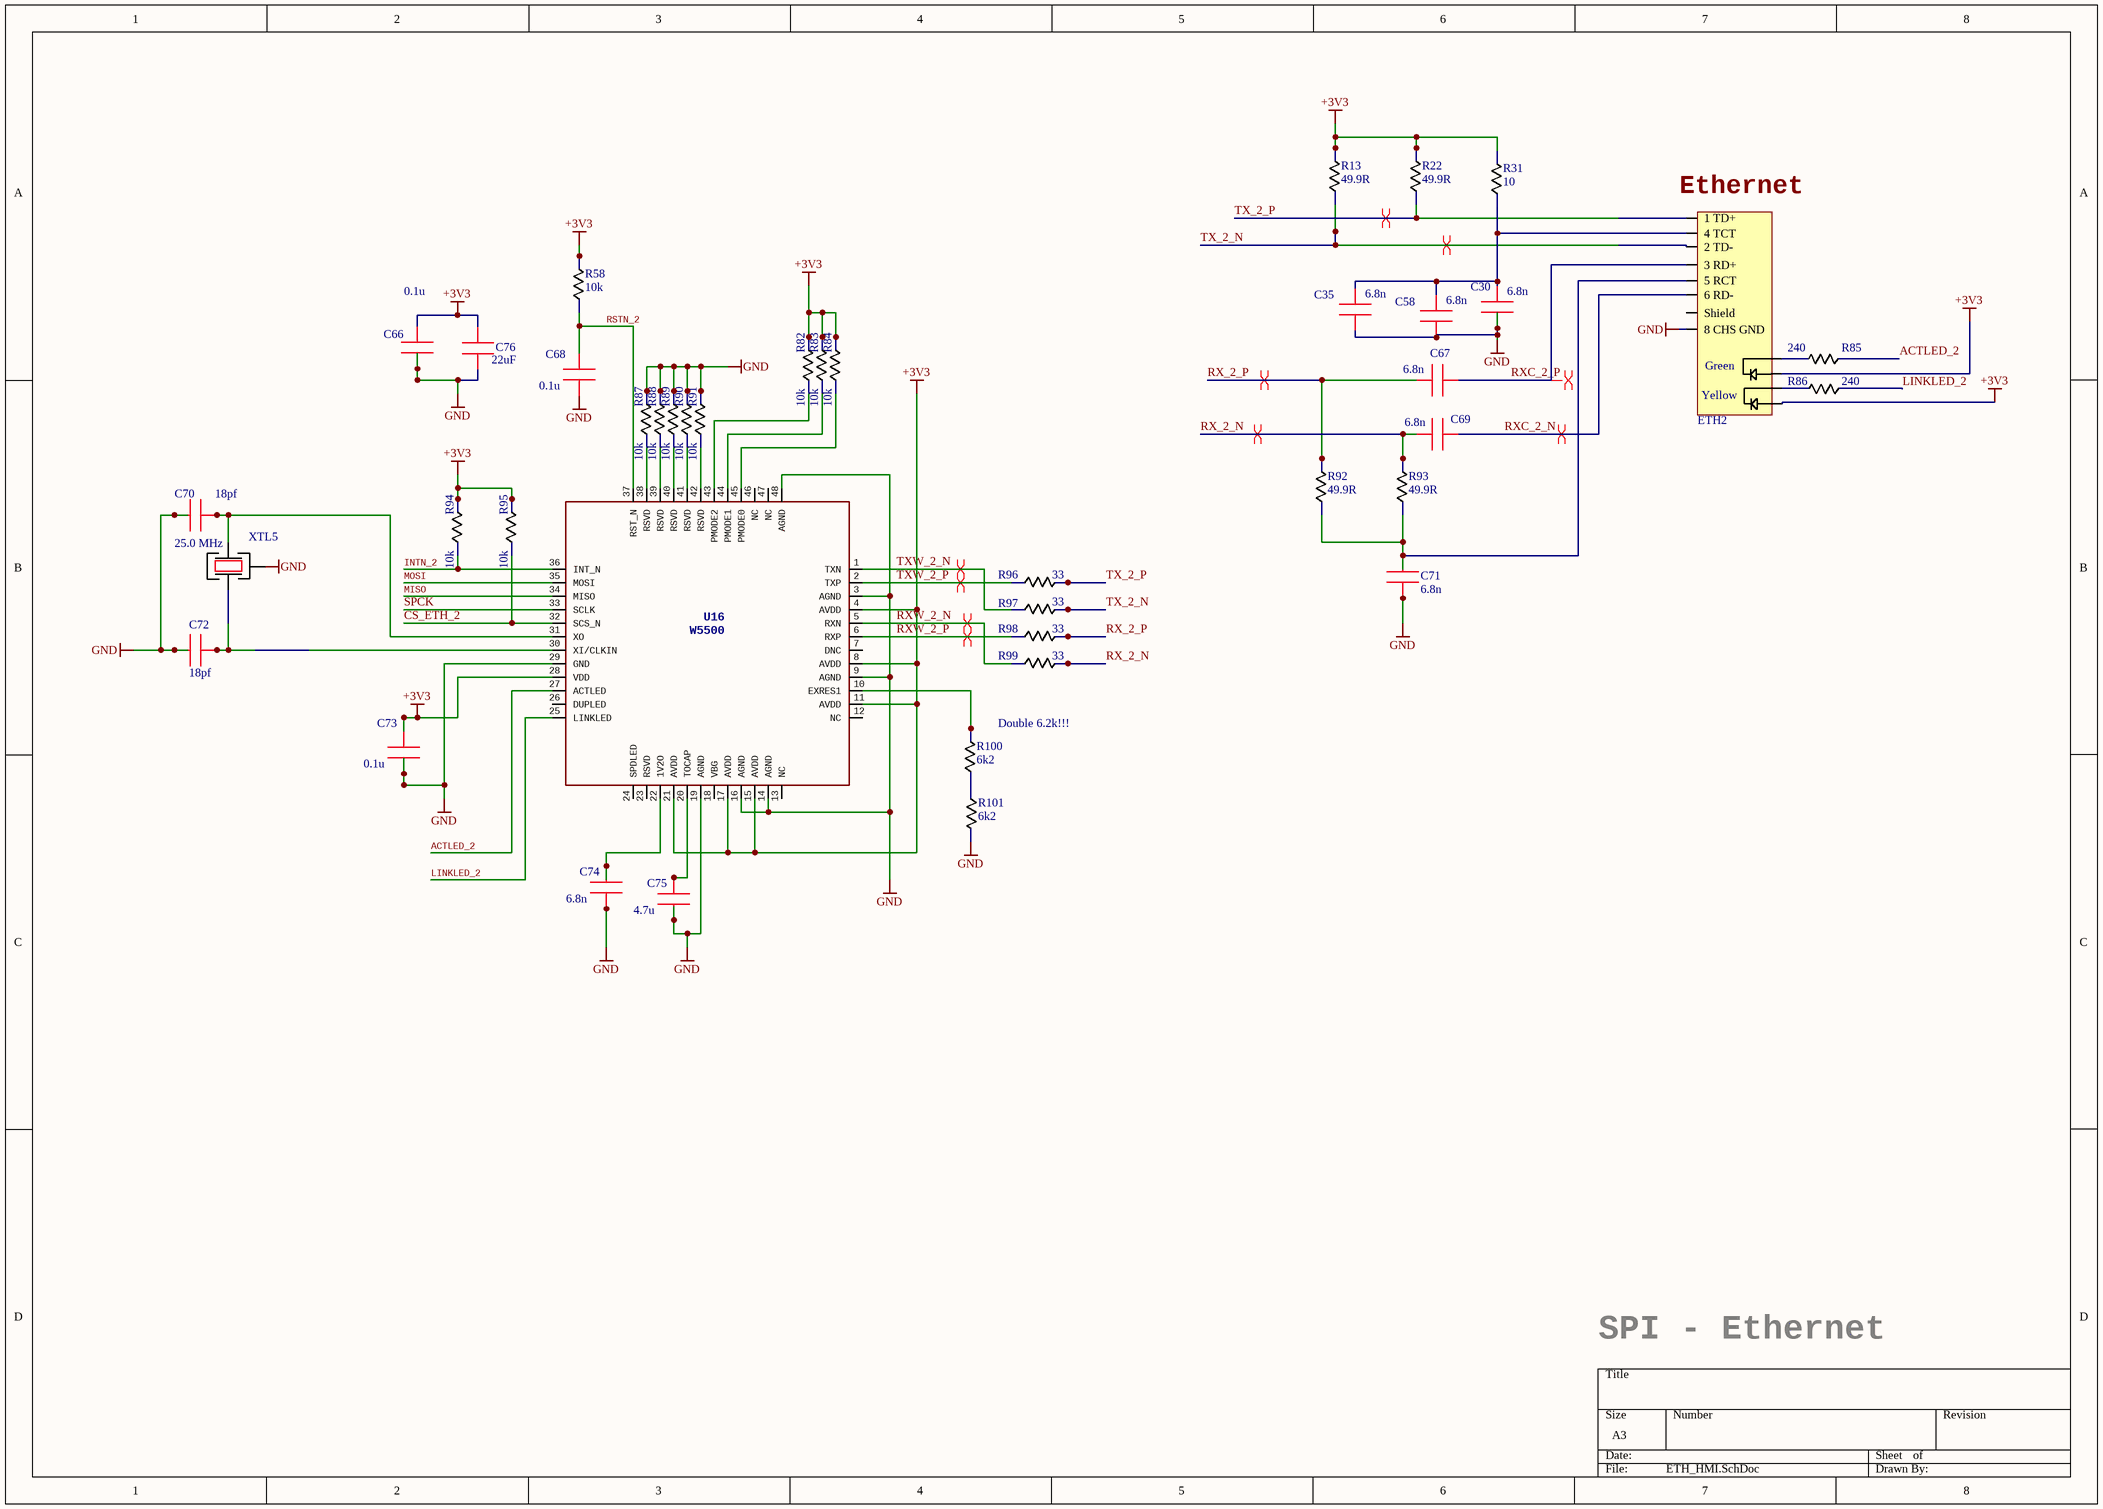
[diagram p7: ETH_HMI.SchDoc]

### Parts
C30  6.8n  [0603 CAP]
C35  6.8n  [0603 CAP]
C58  6.8n  [0603 CAP]
C66  0.1u  [0603 CAP]
C67  6.8n  [0603 CAP]
C68  0.1u  [0603 CAP]
C69  6.8n  [0603 CAP]
C70  18pf  [0603 CAP]
C71  6.8n  [0603 CAP]
C72  18pf  [0603 CAP]
C73  0.1u  [0603 CAP]
C74  6.8n  [0603 CAP]
C75  4.7u  [0603 CAP]
C76  22uF  [CAP CER 1210 NP]
ETH2  ETH?  [J011D21BNL]  (value not drawn)
R13  49.9R  [0603 - RES]
R22  49.9R  [0603 - RES]
R31  10  [0603 - RES]
R58  10k  [0603 - RES]
R82  10k  [0603 - RES]
R83  10k  [0603 - RES]
R84  10k  [0603 - RES]
R85  240  [0603 - RES]
R86  240  [0603 - RES]
R87  10k  [0603 - RES]
R88  10k  [0603 - RES]
R89  10k  [0603 - RES]
R90  10k  [0603 - RES]
R91  10k  [0603 - RES]
R92  49.9R  [0603 - RES]
R93  49.9R  [0603 - RES]
R94  10k  [0603 - RES]
R95  10k  [0603 - RES]
R96  33  [0603 - RES]
R97  33  [0603 - RES]
R98  33  [0603 - RES]
R99  33  [0603 - RES]
R100  6k2  [0603 - RES]
R101  6k2  [0603 - RES]
U16  W5500  [LQFP 48]
XTL5  25.0 MHz  [XTAL KX-7T]

### Nets
+3V3: C66.1 C73.1 C76.2 ETH2.9(LDGr) ETH2.12(LDYE) R13.2 R22.2 R31.2 R58.2 R82.2 R83.2 R84.2 R94.2 R95.2 U16.4(AVDD) U16.8(AVDD) U16.11(AVDD) U16.15(AVDD) U16.17(AVDD) U16.21(AVDD) U16.28(VDD)
GND: C30.2 C35.2 C58.2 C66.2 C68.2 C70.1 C71.2 C72.1 C73.2 C74.2 C75.2 C76.1 ETH2.8(8_CHS_GND) R87.2 R88.2 R89.2 R90.2 R91.2 R101.2 U16.3(AGND) U16.9(AGND) U16.14(AGND) U16.16(AGND) U16.19(AGND) U16.29(GND) U16.48(AGND) XTL5.2
ACTLED_2: R85.1 U16.27(ACTLED)
CS_ETH_2: R95.1 U16.32(SCS_N)
INTN_2: R94.1 U16.36(INT_N)
LINKLED_2: R86.1 U16.25(LINKLED)
MISO: U16.34(MISO)
MOSI: U16.35(MOSI)
RSTN_2: C68.1 R58.1 U16.37(RST_N)
RX_2_N: C69.1 R93.2 R99.2
RX_2_P: C67.1 R92.2 R98.2
RXC_2_N: C69.2 ETH2.6(6_RD-)
RXC_2_P: C67.2 ETH2.3(3_RD+)
RXW_2_N: R99.1 U16.5(RXN)
RXW_2_P: R98.1 U16.6(RXP)
SPCK: U16.33(SCLK)
TX_2_N: ETH2.2(2_TD-) R13.1 R97.2
TX_2_P: ETH2.1(1_TD+) R22.1 R96.2
TXW_2_N: R97.1 U16.1(TXN)
TXW_2_P: R96.1 U16.2(TXP)
NetC30_1: C30.1 C35.1 C58.1 ETH2.4(4_TCT) R31.1
NetC70_2: C70.2 U16.31(XO) XTL5.3
NetC71_1: C71.1 ETH2.5(5_RCT) R92.1 R93.1
NetC72_2: C72.2 U16.30(XI/CLKIN) XTL5.1
NetC74_1: C74.1 U16.22(1V2O)
NetC75_1: C75.1 U16.20(TOCAP)
NetETH2_10: ETH2.10(LDGr) R85.2
NetETH2_11: ETH2.11(LDYE) R86.2
NetR82_1: R82.1 U16.43(PMODE2)
NetR83_1: R83.1 U16.44(PMODE1)
NetR84_1: R84.1 U16.45(PMODE0)
NetR87_1: R87.1 U16.38(RSVD)
NetR88_1: R88.1 U16.39(RSVD)
NetR89_1: R89.1 U16.40(RSVD)
NetR90_1: R90.1 U16.41(RSVD)
NetR91_1: R91.1 U16.42(RSVD)
NetR100_1: R100.1 R101.1
NetR100_2: R100.2 U16.10(EXRES1)

Not connected (* = marked no-connect by the designer): ETH2 SHIELD(Shield); U16 7(DNC) 12(NC) 13(NC) 18(VBG) 23(RSVD) 24(SPDLED) 26(DUPLED) 46(NC) 47(NC)

### Layout directives
differential pair: RX_2_N, RX_2_P, RXC_2_N, RXC_2_P, RXW_2_N, RXW_2_P, TX_2_N, TX_2_P, TXW_2_N, TXW_2_P

### Notes on the sheet
- (near ETH2) Ethernet
- (near R100) Double 6.2k!!!
- SPI - Ethernet
- (in symbol J0011D21BNL) Green; Yellow

### Library data of the parts
C30 C35 C58 = 0603 CAP: GRM188R71H223KA01D
C66 C68 C73 = 0603 CAP: GRM188R71E104KA01D
C67 C69 = 0603 CAP: CC0603KRX7R9BB682
C70 C72 = 0603 CAP: GRM1885C1H180JA01D
C71 C74 = 0603 CAP
C75 = 0603 CAP: GRM188R61A475KE15D
C76 = 0805 Cap: CC1210KKX5R7BB226
ETH2 = J0011D21BNL
R13 R22 R92 R93 = 0603 RES: RC0603FR-0749R9
R31 R85 R86 = 0603 RES: CRCW060310R0FKEA
R58 R82-R84 R87-R91 R94 R95 = 0603 RES: RC0603JR-0710K
R96-R99 = 0603 RES: RC0603FR-0733R
R100 = 0603 RES: RC0603FR-076K2
R101 = Resistor 0805: 0805 SMD Resistor
XTL5 = KX-7: Geyer KX-7 25.0 MHz

## Nets that join several sheets
+3V3: Power Supply (C24.2 C32.1 U3.2), LEDs (R69.2), Ethernet (21 pins), SD Holder (C57.2 R74.1 SD1.4 SD1.SWA), Processor (14 pins), RS485 (16 pins), ETH_HMI (21 pins)
+5V: Power Supply (7 pins), RS485 (21 pins)
+24V: Power Supply (F2.2), Plugs (P3.4)
GND: Power Supply (16 pins), LEDs (10 pins), Plugs (J1.0 J1.4 P3.5), Ethernet (27 pins), SD Holder (C57.1 SD1.6), Processor (35 pins), RS485 (47 pins), ETH_HMI (27 pins)
CS_ETH: Ethernet (R57.1 U11.32), Processor (U1.102)
CS_ETH_2: Processor (U1.97), ETH_HMI (R95.1 U16.32)
CS_SD: SD Holder (R74.2 SD1.2), Processor (U1.7)
CS_UA1: Processor (U1.139), RS485 (R16.2 U17.2)
CS_UA2: Processor (U1.136), RS485 (R26.2 U18.2)
CS_UA3: Processor (U1.135), RS485 (R35.2 U19.2)
D+_P: Plugs (J1.3), Processor (R4.2 U1.37 Z1.1)
D-_N: Plugs (J1.2), Processor (R3.2 U1.38 Z2.1)
INTN: Ethernet (R56.1 U11.36), Processor (U1.144)
INTN_2: Processor (U1.98), ETH_HMI (R94.1 U16.36)
MISO: Ethernet (U11.34), SD Holder (SD1.7), Processor (U1.108), RS485 (U17.4 U18.4 U19.4), ETH_HMI (U16.34)
MOSI: Ethernet (U11.35), SD Holder (SD1.3), Processor (U1.109), RS485 (U17.3 U18.3 U19.3), ETH_HMI (U16.35)
PLC_OK: LEDs (R67.2), Processor (U1.66)
RS1_N: Plugs (P1.2), RS485 (R19.2 R77.2 TVS2.1 U6.A)
RS1_P: Plugs (P1.1), RS485 (R19.1 R77.1 TVS2.2 U6.B)
RS2_N: Plugs (P1.4), RS485 (R28.2 R79.2 TVS5.1 U8.A)
RS2_P: Plugs (P1.3), RS485 (R28.1 R79.1 TVS5.2 U8.B)
RS3_N: Plugs (P1.6), RS485 (R37.2 R81.2 TVS7.1 U10.A)
RS3_P: Plugs (P1.5), RS485 (R37.1 R81.1 TVS7.2 U10.B)
RS4_N: Plugs (P1.8), RS485 (R18.2 R76.2 TVS3.1 U5.A)
RS4_P: Plugs (P1.7), RS485 (R18.1 R76.1 TVS3.2 U5.B)
RS5_N: Plugs (P1.10), RS485 (R24.2 R78.2 TVS4.1 U7.A)
RS5_P: Plugs (P1.9), RS485 (R24.1 R78.1 TVS4.2 U7.B)
RS6_N: Plugs (P1.12), RS485 (R33.2 R80.2 TVS6.1 U9.A)
RS6_P: Plugs (P1.11), RS485 (R33.1 R80.1 TVS6.2 U9.B)
RTS4: LEDs (R70.2), Processor (U1.134), RS485 (U5.TxEn1 U5.TxEn2)
RTS5: LEDs (R72.2), Processor (U1.132), RS485 (U7.TxEn1 U7.TxEn2)
RTS6: LEDs (R73.2), Processor (U1.133), RS485 (U9.TxEn1 U9.TxEn2)
RTSX: Processor (U1.100), RS485 (U4.TxEn1 U4.TxEn2)
RX: Processor (U1.27), RS485 (U13.4)
RXD1: Processor (U1.3), RS485 (U12.4)
RXD2: Processor (U1.5), RS485 (U15.4)
RXD3: Processor (U1.18), RS485 (U14.4)
SD_Detect: SD Holder (SD1.SWB), Processor (U1.13)
SD_OK: LEDs (R65.2), Processor (U1.67)
SPCK: Ethernet (U11.33), SD Holder (SD1.5), Processor (U1.110), RS485 (U17.5 U18.5 U19.5), ETH_HMI (U16.33)
TX: Processor (U1.2), RS485 (U4.Tx)
TXD1: Processor (U1.4), RS485 (U5.Tx)
TXD2: Processor (U1.6), RS485 (U9.Tx)
TXD3: Processor (U1.17), RS485 (U7.Tx)
UART1_IRQ: Processor (U1.16), RS485 (R20.1 U17.7)
UART2_IRQ: Processor (U1.15), RS485 (R29.1 U18.7)
UART3_IRQ: Processor (U1.14), RS485 (R38.1 U19.7)
UART_RTS_1: LEDs (R64.2), RS485 (U6.TxEn1 U6.TxEn2 U17.10)
UART_RTS_2: LEDs (R66.2), RS485 (U8.TxEn1 U8.TxEn2 U18.10)
UART_RTS_3: LEDs (R68.2), RS485 (U10.TxEn1 U10.TxEn2 U19.10)
X2X_Led: LEDs (R71.2), Processor (U1.8)
X_H: Plugs (P3.2), RS485 (TVS8.2 U4.B)
X_L: Plugs (P3.1), RS485 (TVS8.1 U4.A)
XUSB: Plugs (J1.1), Processor (U1.39)